# EAGLE design StickIt-LedDigits (EAGLE 5.11)
AUTHOR: Dave Vandenbout / XESS Corp.; DIGIKEY#: 742C163330JPCT-ND; MANF: CTS Resistor Products; MANF#: 742C163330JPTR; MOUSER#: 774-742C163330JP; VERSION#: 2.0
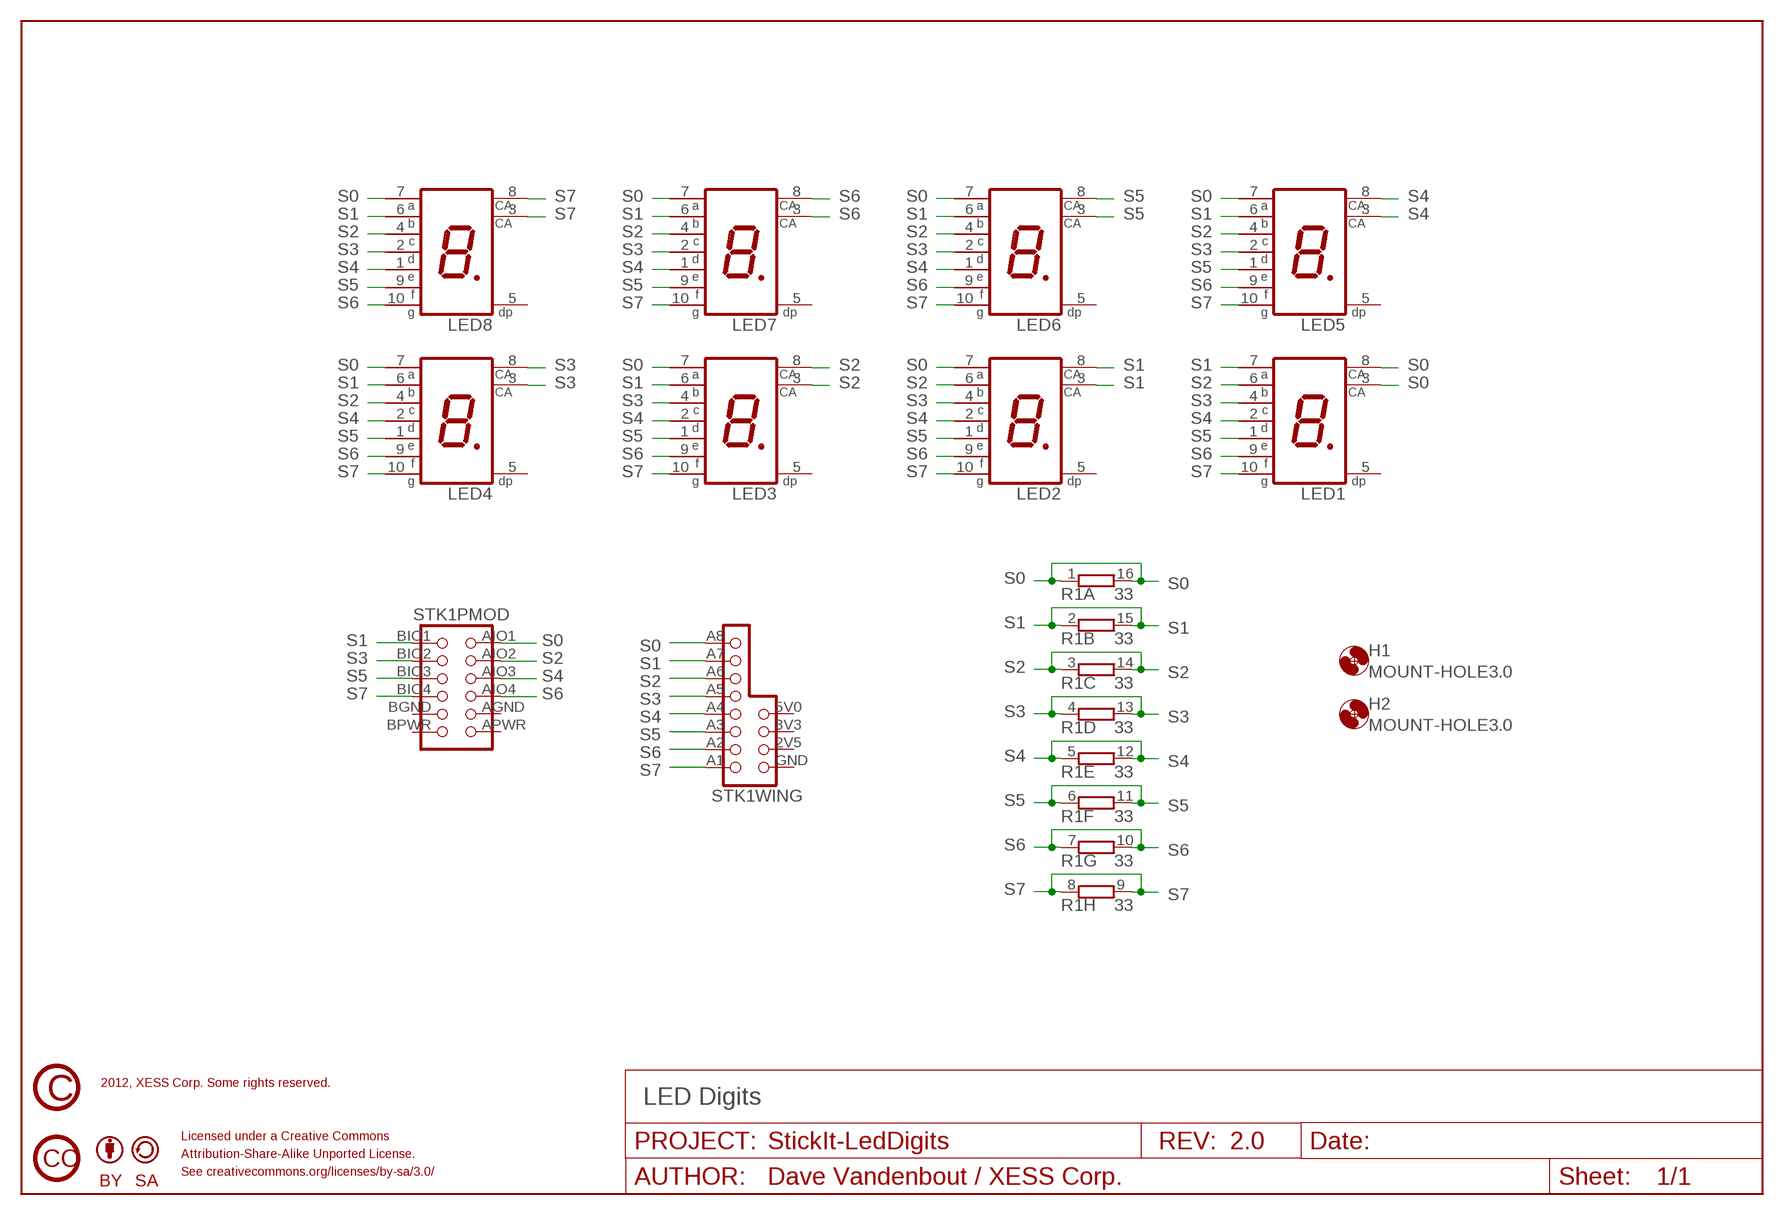
[diagram p0: schematic, sheet 1]

## Parts
H1  MOUNT-HOLE3.0  [3,0]
H2  MOUNT-HOLE3.0  [3,0]
LED1  7SEGLEDCA0.3"  [KPSA03]
LED2  7SEGLEDCA0.3"  [KPSA03]
LED3  7SEGLEDCA0.3"  [KPSA03]
LED4  7SEGLEDCA0.3"  [KPSA03]
LED5  7SEGLEDCA0.3"  [KPSA03]
LED6  7SEGLEDCA0.3"  [KPSA03]
LED7  7SEGLEDCA0.3"  [KPSA03]
LED8  7SEGLEDCA0.3"  [KPSA03]
R1  33  RES8742  [742C163]
STK1  STICKIT-HEADER1  [STICKIT-HEADER1]
U$2  CC_CC  [CC_CC]
U$3  CC_BY  [CC_BY]
U$4  CC_SA  [CC_SA]
U$5  CC_COPYRIGHT  [CC_COPYRIGHT]

## Nets
S0: LED1.3(CA) LED1.8(CA) LED2.7(A) LED3.7(A) LED4.7(A) LED5.7(A) LED6.7(A) LED7.7(A) LED8.7(A) R1.1 R1.16 STK1.A8(WING:A8) STK1.AIO1(PMOD:AIO1)
S1: LED1.7(A) LED2.3(CA) LED2.8(CA) LED3.6(B) LED4.6(B) LED5.6(B) LED6.6(B) LED7.6(B) LED8.6(B) R1.2 R1.15 STK1.A7(WING:A7) STK1.BIO1(PMOD:BIO1)
S2: LED1.6(B) LED2.6(B) LED3.3(CA) LED3.8(CA) LED4.4(C) LED5.4(C) LED6.4(C) LED7.4(C) LED8.4(C) R1.3 R1.14 STK1.A6(WING:A6) STK1.AIO2(PMOD:AIO2)
S3: LED1.4(C) LED2.4(C) LED3.4(C) LED4.3(CA) LED4.8(CA) LED5.2(D) LED6.2(D) LED7.2(D) LED8.2(D) R1.4 R1.13 STK1.A5(WING:A5) STK1.BIO2(PMOD:BIO2)
S4: LED1.2(D) LED2.2(D) LED3.2(D) LED4.2(D) LED5.3(CA) LED5.8(CA) LED6.1(E) LED7.1(E) LED8.1(E) R1.5 R1.12 STK1.A4(WING:A4) STK1.AIO3(PMOD:AIO3)
S5: LED1.1(E) LED2.1(E) LED3.1(E) LED4.1(E) LED5.1(E) LED6.3(CA) LED6.8(CA) LED7.9(F) LED8.9(F) R1.6 R1.11 STK1.A3(WING:A3) STK1.BIO3(PMOD:BIO3)
S6: LED1.9(F) LED2.9(F) LED3.9(F) LED4.9(F) LED5.9(F) LED6.9(F) LED7.3(CA) LED7.8(CA) LED8.10(G) R1.7 R1.10 STK1.A2(WING:A2) STK1.AIO4(PMOD:AIO4)
S7: LED1.10(G) LED2.10(G) LED3.10(G) LED4.10(G) LED5.10(G) LED6.10(G) LED7.10(G) LED8.3(CA) LED8.8(CA) R1.8 R1.9 STK1.A1(WING:A1) STK1.BIO4(PMOD:BIO4)
Unconnected: LED1.5(DP) LED2.5(DP) LED3.5(DP) LED4.5(DP) LED5.5(DP) LED6.5(DP) LED7.5(DP) LED8.5(DP) STK1.2V5(WING:2V5) STK1.3V3(WING:3V3) STK1.5V0(WING:5V) STK1.AGND(PMOD:AGND) STK1.APWR(PMOD:APWR) STK1.BGND(PMOD:BGND) STK1.BPWR(PMOD:BPWR) STK1.GND(WING:GND)

## Notes on the sheet
- 2012, XESS Corp. Some rights reserved.
- LED Digits
- Licensed under a Creative Commons
- Attribution-Share-Alike Unported License.
- See creativecommons.org/licenses/by-sa/3.0/

## Library data of the parts
H1 H2 = holes:MOUNT-HOLE: MOUNTING HOLE with drill center marker
LED1-LED8 = xess:7SEGLEDCA: Common-anode 7-segment LED display; COLOR: RED; DIGIKEY#: 754-1023-1-ND; MANF: Kingbright; MANF#: ACSA03-41EWA-F01; MOUSER#: 604-ACSA03-41EWA
R1 = xess:RES8: Resistor 8-pack Package of eight resistors.; DIGIKEY#: 742C163???JPCT-ND; MANF: CTS Resistor Products; MANF#: 742C163???JPTR; MOUSER#: 774-742C163???JP
STK1 = xess:STICKIT-HEADER: StickIt Header Combined PMOD and Papilio Wing header for use on StickIt add-on boards.
U$2 = xess:CC_CC
U$3 = xess:CC_BY
U$4 = xess:CC_SA
U$5 = xess:CC_COPYRIGHT

## Net classes
1 power: clearance 0.254 mm

## Board
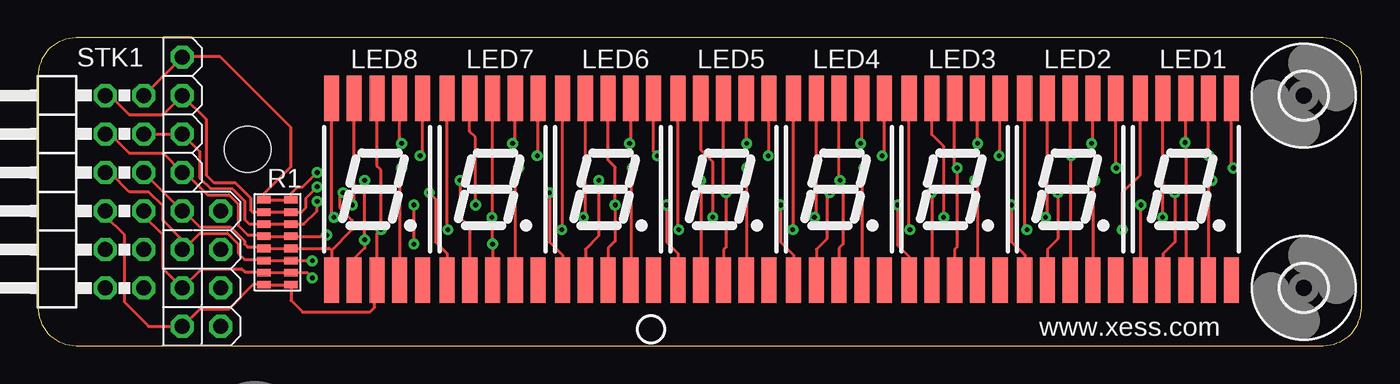
[diagram p1: board, top side]
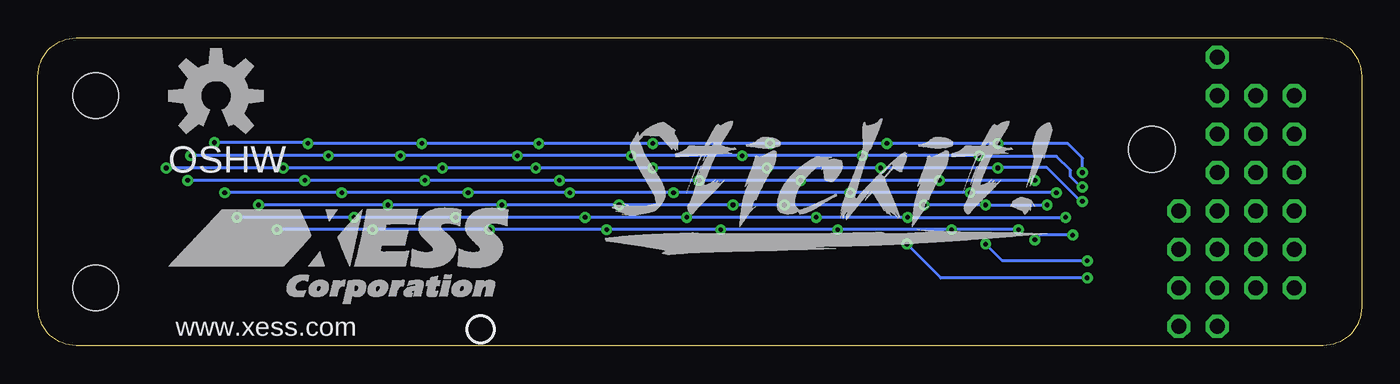
[diagram p2: board, bottom side, seen from below]

Size 87.31 x 20.32 mm. Coordinates in mm from the lower left corner, seen from the top.
Outline: 2.54,0 84.77,0 arc90 87.31,2.54 87.31,17.78 arc90 84.77,20.32 2.54,20.32 arc90 0,17.78 0,2.54 arc90 2.54,0
Copper layers (1*16): Top 0.035mm / dielectric 1.5mm / Bottom 0.035mm
Design rules "ITeadstudio_safe": minimum track width 8mil, minimum drill 12mil, track to track 8mil, track to pad 8mil, pad to pad 8mil, via to via 8mil, smd to smd 0mil, copper to edge 10mil, drill to drill 10mil, minimum pad ring 10mil, minimum via ring 8mil, stop-mask expansion 2mil, vias tented up to drill 100mil, thermal gap 10mil

### Footprints (pad centres in the part's own frame; a part is rotated, then mirrored left to right if it is on the bottom)
3,0 = hole 3: 0,0
KPSA03 = smd 1 x 3: 1 0,0; 2 1.5,0; 3 3,0; 4 4.5,0; 5 6,0; 6 6,12; 7 4.5,12; 8 3,12; 9 1.5,12; 10 0,12
742C163 = smd 0.5 x 0.9: 1 -2.8,-0.9; 2 -2,-0.9; 3 -1.2,-0.9; 4 -0.4,-0.9; 5 0.4,-0.9; 6 1.2,-0.9; 7 2,-0.9; 8 2.8,-0.9; 9 2.8,0.9; 10 2,0.9; 11 1.2,0.9; 12 0.4,0.9; 13 -0.4,0.9; 14 -1.2,0.9; 15 -2,0.9; 16 -2.8,0.9
STICKIT-HEADER1 = drill 1 octagon: 2V5 5.08,-15.24; 3V3 5.08,-12.7; 5V0 5.08,-10.16; A1 2.54,-17.78; A2 2.54,-15.24; A3 2.54,-12.7; A4 2.54,-10.16; A5 2.54,-7.62; A6 2.54,-5.08; A7 2.54,-2.54; A8 2.54,0; AGND 0,-12.7; AIO1 0,-2.54; AIO2 0,-5.08; AIO3 0,-7.62; AIO4 0,-10.16; APWR 0,-15.24; BGND -2.54,-12.7; BIO1 -2.54,-2.54; BIO2 -2.54,-5.08; BIO3 -2.54,-7.62; BIO4 -2.54,-10.16; BPWR -2.54,-15.24; GND 5.08,-17.78 | hole 3.048: 6.858,-6.096

### Placement (x,y rotation side)
H1  83.5,3.81 0 top
H2  83.5,16.51 0 top
LED1  72.71,4.33 0 top
LED2  65.09,4.33 0 top
LED3  57.47,4.33 0 top
LED4  49.85,4.33 0 top
LED5  42.23,4.33 0 top
LED6  34.61,4.33 0 top
LED7  26.99,4.33 0 top
LED8  19.37,4.33 0 top
R1  15.8,6.82 270 top
STK1  6.99,19.05 0 top
U$2  14.29,-14.61 0 top  (outside the outline)
U$3  21.27,-13.34 0 top  (outside the outline)
U$4  26.35,-13.34 0 top  (outside the outline)
U$5  14.29,-5.71 0 top  (outside the outline)

### Tracks (layer width: path | path; a pad name or v marks a point on that pad's centre or on a via)
S0  (via drill 0.3)
  Top 0.203: STK1.AIO1 STK1.A8 9.58,19.1 12,19.1 16.68,14.43 16.68,11.8 14.9,10.02 R1.1 R1.16 16.7,10.03 17.14,10.48 17.46,10.48 v18.41,11.43 | LED8.7 23.87,13.47 v23.99,13.35 | LED7.7 31.49,13.53 v31.31,13.35 | LED6.7 39.11,13.43 v39.03,13.35 | LED5.7 46.73,13.37 v46.75,13.35 | LED4.7 54.35,13.43 v54.27,13.35 | LED3.7 61.97,13.37 v61.99,13.35 | LED2.7 69.59,13.43 v69.51,13.35 | LED1.8 75.71,13.45 v75.67,13.41 75.71,13.37 LED1.3
  Bottom 0.203: v75.67,13.41 69.57,13.41 v69.51,13.35 v61.99,13.35 v54.27,13.35 v46.75,13.35 v39.03,13.35 v31.31,13.35 v23.99,13.35 23.98,13.34 19.37,13.34 18.41,12.38 v18.41,11.43
S1  (via drill 0.3)
  Top 0.203: STK1.BIO1 4.76,16.51 6.03,15.24 8.25,15.24 STK1.A7 11.09,14.95 11.09,11.28 11.6,10.77 13.02,10.77 14.03,9.75 14.03,8.94 14.15,8.82 R1.2 R1.15 17.39,8.82 17.68,9.11 17.68,9.74 v18.41,10.48 | LED8.6 25.37,12.69 v25.21,12.54 | LED7.6 32.99,12.59 v32.93,12.54 | LED6.6 40.61,12.78 v40.86,12.54 | LED5.6 48.23,12.59 v48.17,12.54 | LED4.6 55.85,12.69 v55.69,12.54 | LED3.6 63.47,12.59 v63.41,12.54 | LED1.7 77.21,12.56 v77.23,12.54 | LED2.8 68.09,12.6 v68.15,12.54 68.09,12.47 LED2.3
  Bottom 0.203: v77.23,12.54 v68.15,12.54 v63.41,12.54 v55.69,12.54 v48.17,12.54 v40.86,12.54 v32.93,12.54 v25.21,12.54 25.17,12.5 20.12,12.5 19.2,11.58 19.2,11.18 18.5,10.48 v18.41,10.48
S2  (via drill 0.3)
  Top 0.203: STK1.AIO2 STK1.A6 10.68,12.81 10.68,11.07 11.39,10.36 12.81,10.36 13.63,9.55 13.63,8.33 13.94,8.02 R1.3 R1.14 17.54,8.02 18.41,8.89 v18.41,9.53 | LED8.4 23.87,11.6 v23.99,11.72 | LED7.4 31.49,11.5 v31.71,11.72 | LED6.4 39.11,11.6 v39.23,11.72 | LED5.4 46.73,11.7 v46.75,11.72 | LED4.4 54.35,11.6 v54.47,11.72 | LED2.6 71.09,11.77 v71.13,11.72 | LED1.6 78.71,11.87 v78.85,11.72 | LED3.8 60.47,11.88 v60.63,11.72 60.63,6.5 60.47,6.34 LED3.3
  Bottom 0.203: 79.06,11.72 v78.85,11.72 v71.13,11.72 v60.63,11.72 v54.47,11.72 v46.75,11.72 v39.23,11.72 v31.71,11.72 v23.99,11.72 23.96,11.75 20.75,11.75 18.53,9.53 v18.41,9.53
S3  (via drill 0.3)
  Top 0.203: STK1.BIO2 4.76,13.97 6.03,12.7 8.25,12.7 STK1.A5 9.72,11.43 11.19,9.96 12.61,9.96 13.22,9.35 13.22,7.92 13.83,7.32 14.8,7.32 R1.4 R1.13 18.97,7.22 v19.05,7.3 | LED8.2 20.87,5.75 21.55,6.44 v21.55,6.99 v21.55,10.91 | LED7.2 28.49,7.83 27.85,8.47 v27.85,10.91 | LED6.2 36.11,6.36 37,7.25 v37,10.91 | LED5.2 43.73,10.88 v43.7,10.91 | LED3.4 61.97,10.73 v61.79,10.91 | LED2.4 69.59,10.79 v69.71,10.91 | LED1.4 77.21,10.69 v77.43,10.91 | LED4.8 52.85,10.97 v52.91,10.91 53.11,10.71 53.11,6.71 52.85,6.44 LED4.3
  Bottom 0.203: v21.55,10.91 v27.85,10.91 v37,10.91 v43.7,10.91 v52.91,10.91 v61.79,10.91 v69.71,10.91 v77.43,10.91 | v19.05,7.3 21.23,7.3 v21.55,6.99
S4  (via drill 0.3)
  Top 0.203: STK1.AIO3 STK1.A4 9.61,8.89 10.68,7.82 12.71,7.82 13.63,6.91 13.63,6.71 13.83,6.5 14.82,6.5 R1.5 R1.12 19.23,6.42 19.37,6.29 | 19.37,6.29 LED8.1 | 19.37,6.29 20.74,7.66 20.74,8.27 19.93,9.08 19.93,9.89 v20.13,10.1 | LED7.1 26.99,6.08 26.23,6.84 26.23,9.69 v25.82,10.1 | LED6.1 34.61,5.98 33.74,6.84 v33.74,10.1 | LED4.2 51.35,6.36 52.03,7.05 52.03,9.89 v52.24,10.1 | LED3.2 58.97,10.07 v58.94,10.1 | LED2.2 66.59,6.36 67.27,7.05 v67.27,10.1 | LED1.2 74.21,6.06 74.99,6.84 v74.99,10.1 | LED5.8 45.23,10.26 v45.39,10.1 45.39,6.5 45.23,6.34 LED5.3
  Bottom 0.203: v20.13,10.1 v25.82,10.1 v33.74,10.1 v45.39,10.1 v52.24,10.1 v58.94,10.1 v67.27,10.1 v74.99,10.1
S5  (via drill 0.3)
  Top 0.203: STK1.BIO3 4.76,11.43 6.03,10.16 7.3,10.16 8.25,9.21 8.25,8.26 9.53,6.99 STK1.A3 9.61,6.35 10.68,7.42 12.51,7.42 13.22,6.71 13.22,6.1 13.63,5.69 14.83,5.69 R1.6 R1.11 17.88,5.62 v18.1,5.6 | LED8.9 20.87,9.41 v20.74,9.28 | LED5.1 42.23,6.08 41.47,6.84 v41.47,9.28 | LED4.1 49.85,5.98 48.98,6.84 v48.98,9.28 | LED3.1 57.47,5.88 56.71,6.64 v56.71,9.28 | LED2.1 65.09,5.98 64.22,6.84 v64.22,9.28 | LED1.1 72.71,9.23 v72.76,9.28 | LED7.9 28.49,14.13 28.87,13.75 v28.87,9.28 | 37.6,4.12 LED6.3 37.61,6.44 38.07,6.91 v38.07,9.28 38.07,11.79 37.61,12.25 LED6.8 | v24.8,6.71 v24.8,9.28
  Bottom 0.203: v72.76,9.28 v64.22,9.28 v56.71,9.28 v48.98,9.28 v41.47,9.28 v38.07,9.28 v28.87,9.28 v24.8,9.28 v20.74,9.28 20.66,9.21 | v18.1,5.6 23.7,5.6 v24.8,6.71
S6  (via drill 0.3)
  Top 0.203: STK1.AIO4 6.99,8.57 8.25,7.3 8.25,5.08 STK1.A2 10.8,5.08 13.42,5.08 13.63,4.88 14.84,4.88 R1.7 R1.10 17.75,4.82 v18.1,4.47 | LED8.10 19.37,8.62 v19.52,8.47 | LED6.9 36.11,8.6 v35.98,8.47 | LED5.9 43.73,12.91 44.51,12.13 v44.51,8.47 | LED4.9 51.35,8.6 v51.22,8.47 | LED3.9 58.97,13.93 59.75,13.14 v59.75,8.47 | LED2.9 66.59,8.6 v66.46,8.47 | LED1.9 74.21,8.5 v74.18,8.47 | LED7.8 29.99,8.51 v29.95,8.47 29.99,8.43 v29.99,6.71 LED7.3
  Bottom 0.203: v19.52,8.47 v29.95,8.47 v35.98,8.47 v44.51,8.47 v51.22,8.47 v59.75,8.47 v66.46,8.47 v74.18,8.47 | v18.1,4.47 27.75,4.47 v29.99,6.71
S7  (via drill 0.3)
  Top 0.203: STK1.BIO4 4.44,8.57 5.71,7.3 5.71,2.86 7.3,1.27 STK1.A1 10.69,2.44 12.61,2.44 14.24,4.06 14.65,4.06 R1.8 R1.9 16.7,2.99 17.46,2.22 21.91,2.22 22.22,2.54 22.22,4.19 LED8.3 | LED7.10 26.99,7.81 v27.04,7.66 | LED6.10 34.61,7.71 v34.56,7.66 | LED5.10 42.23,7.71 v42.28,7.66 | LED4.10 49.85,7.71 v49.8,7.66 | LED3.10 57.47,7.71 v57.52,7.66 | LED2.10 65.09,7.81 v65.24,7.66 | LED1.10 72.71,11.27 71.54,10.1 v71.54,7.66 | LED8.3 22.36,4.12 | LED8.3 22.37,7.39 v22.63,7.66 22.63,11.58 22.37,11.85 LED8.8
  Bottom 0.203: v22.63,7.66 v27.04,7.66 v34.56,7.66 v42.28,7.66 v49.8,7.66 v57.52,7.66 v65.24,7.66 v71.54,7.66

### Text on the board
tPlace: www.xess.com
bPlace: OSHW | www.xess.com
tDocu: 2012, XESS Corp. Some rights reserved. | Licensed under a Creative Commons | Attribution-Share-Alike Unported License. | See creativecommons.org/licenses/by-sa/3.0/